# EasyEDA Pro project ProPrj_HPMDuino_DEV_2025-07-16.epro, board Board1_钢网
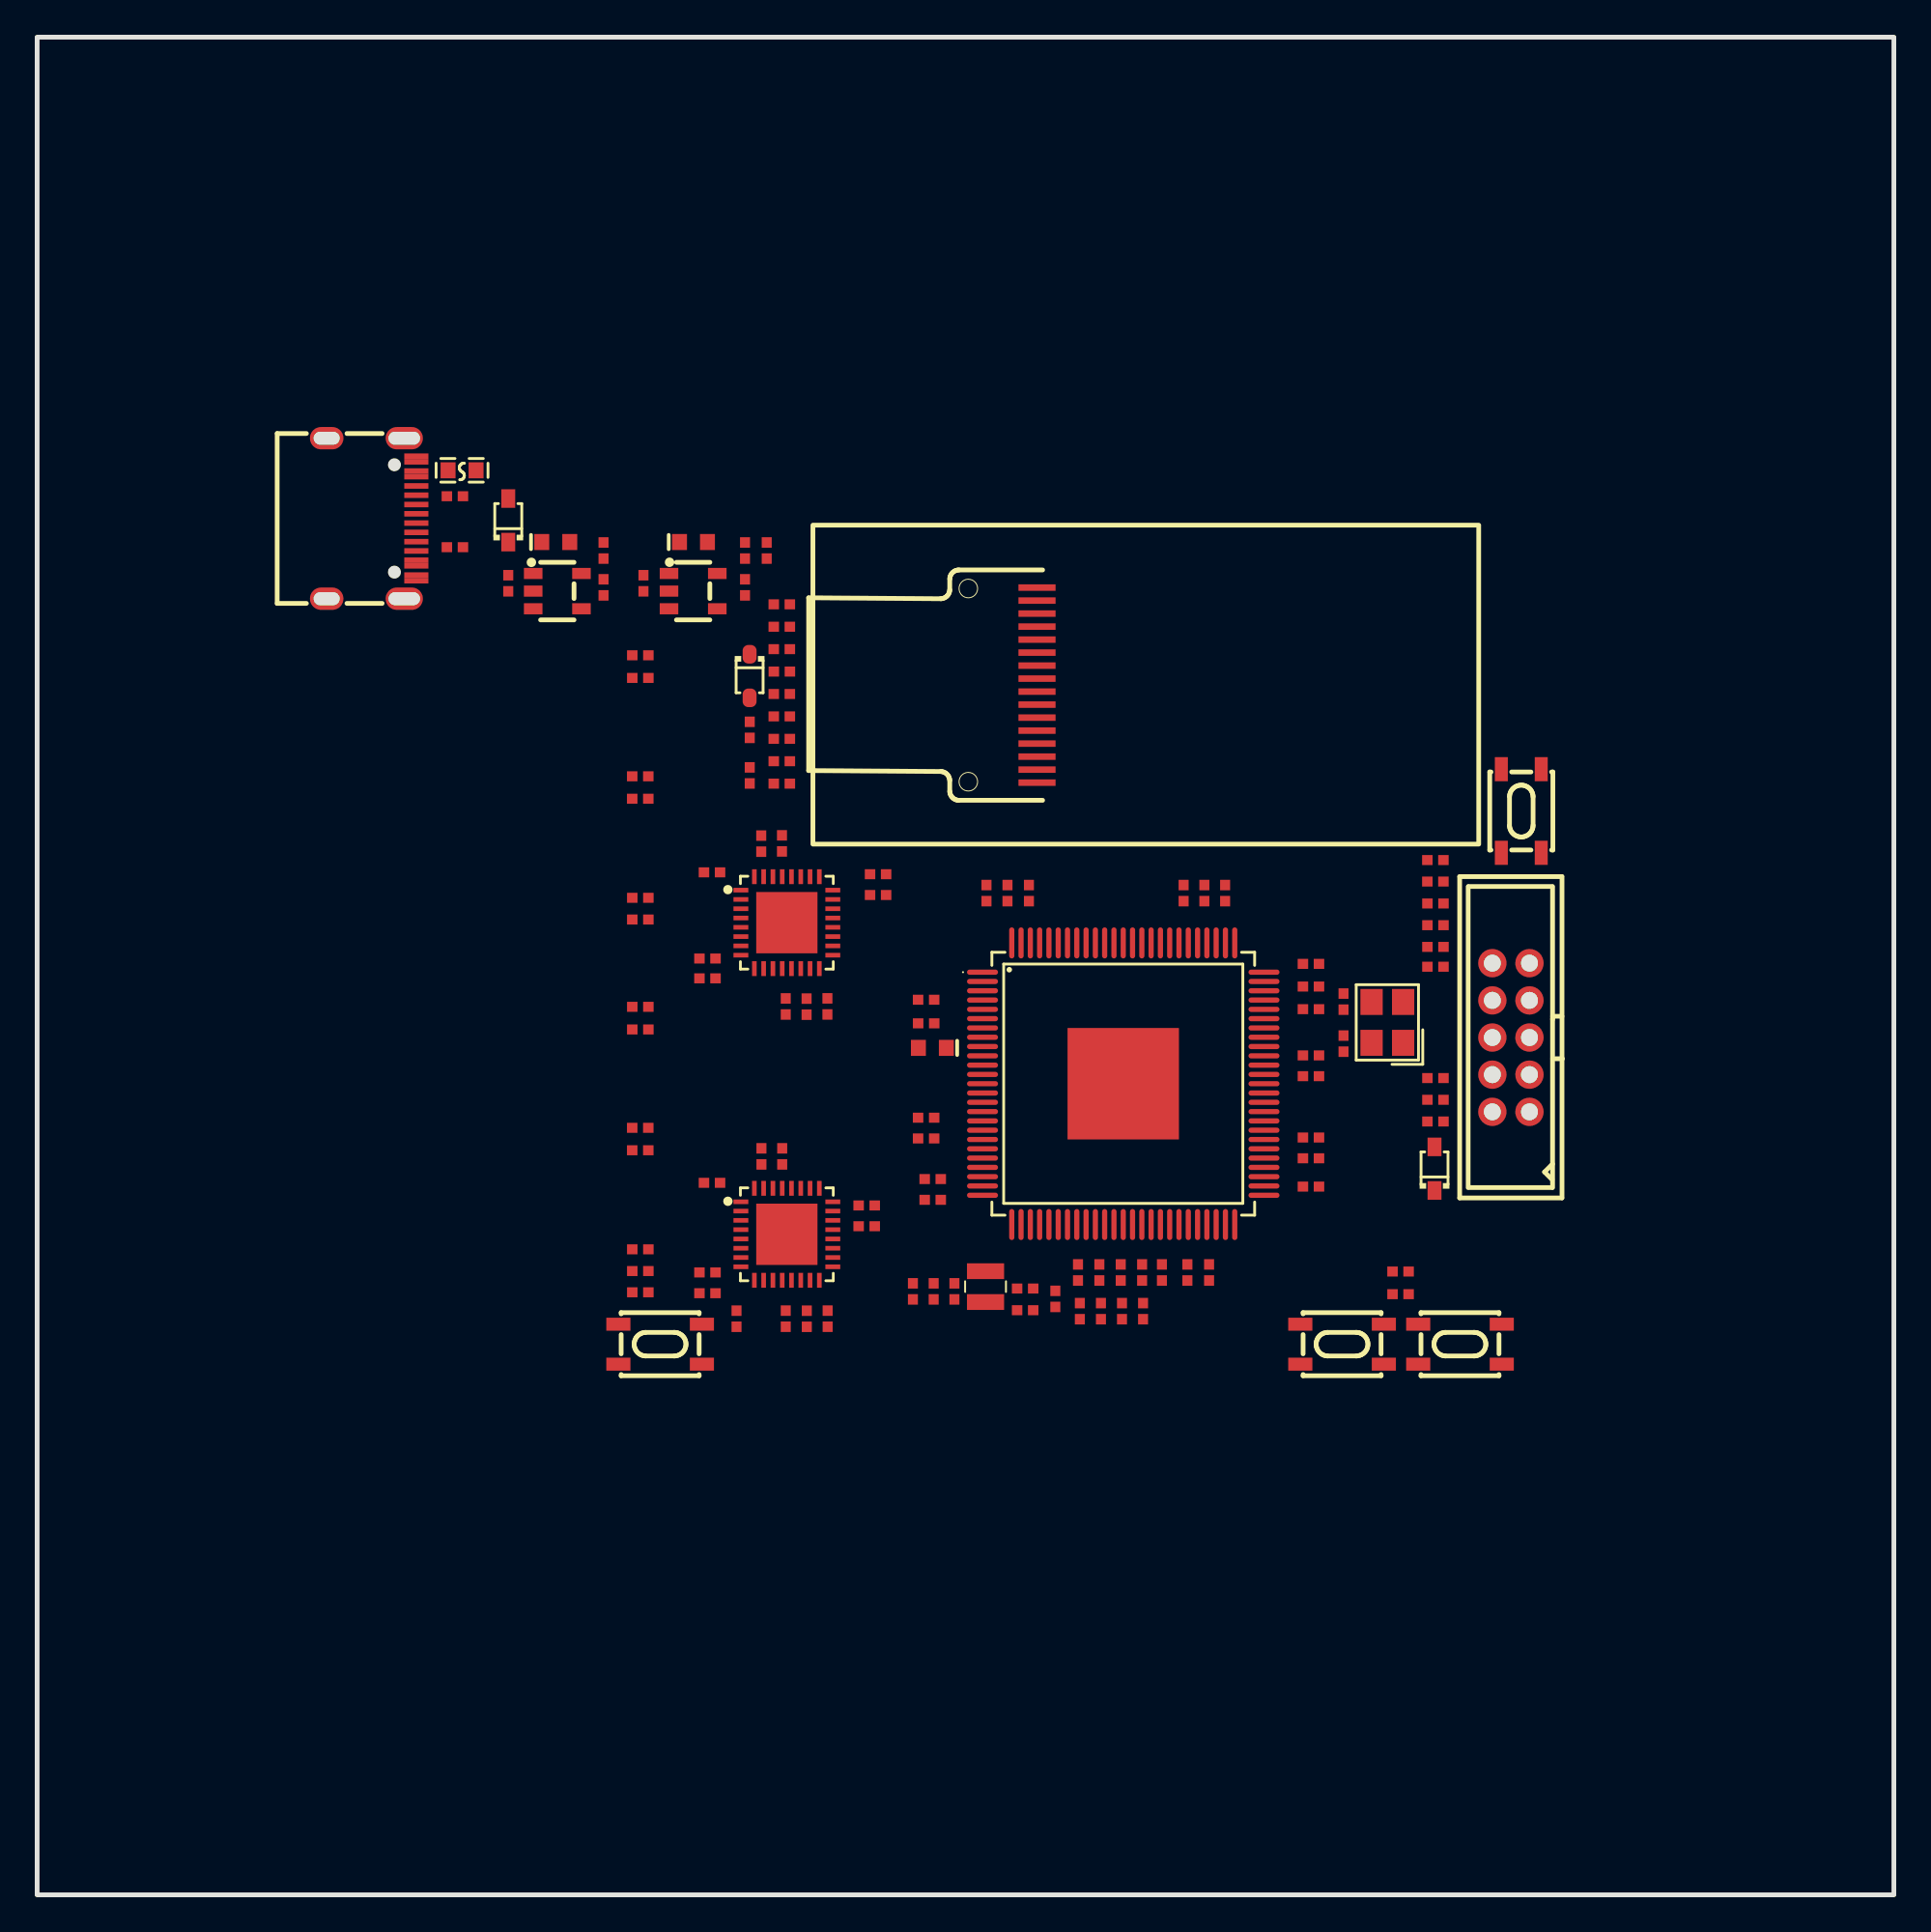
[diagram p2: board, top side]
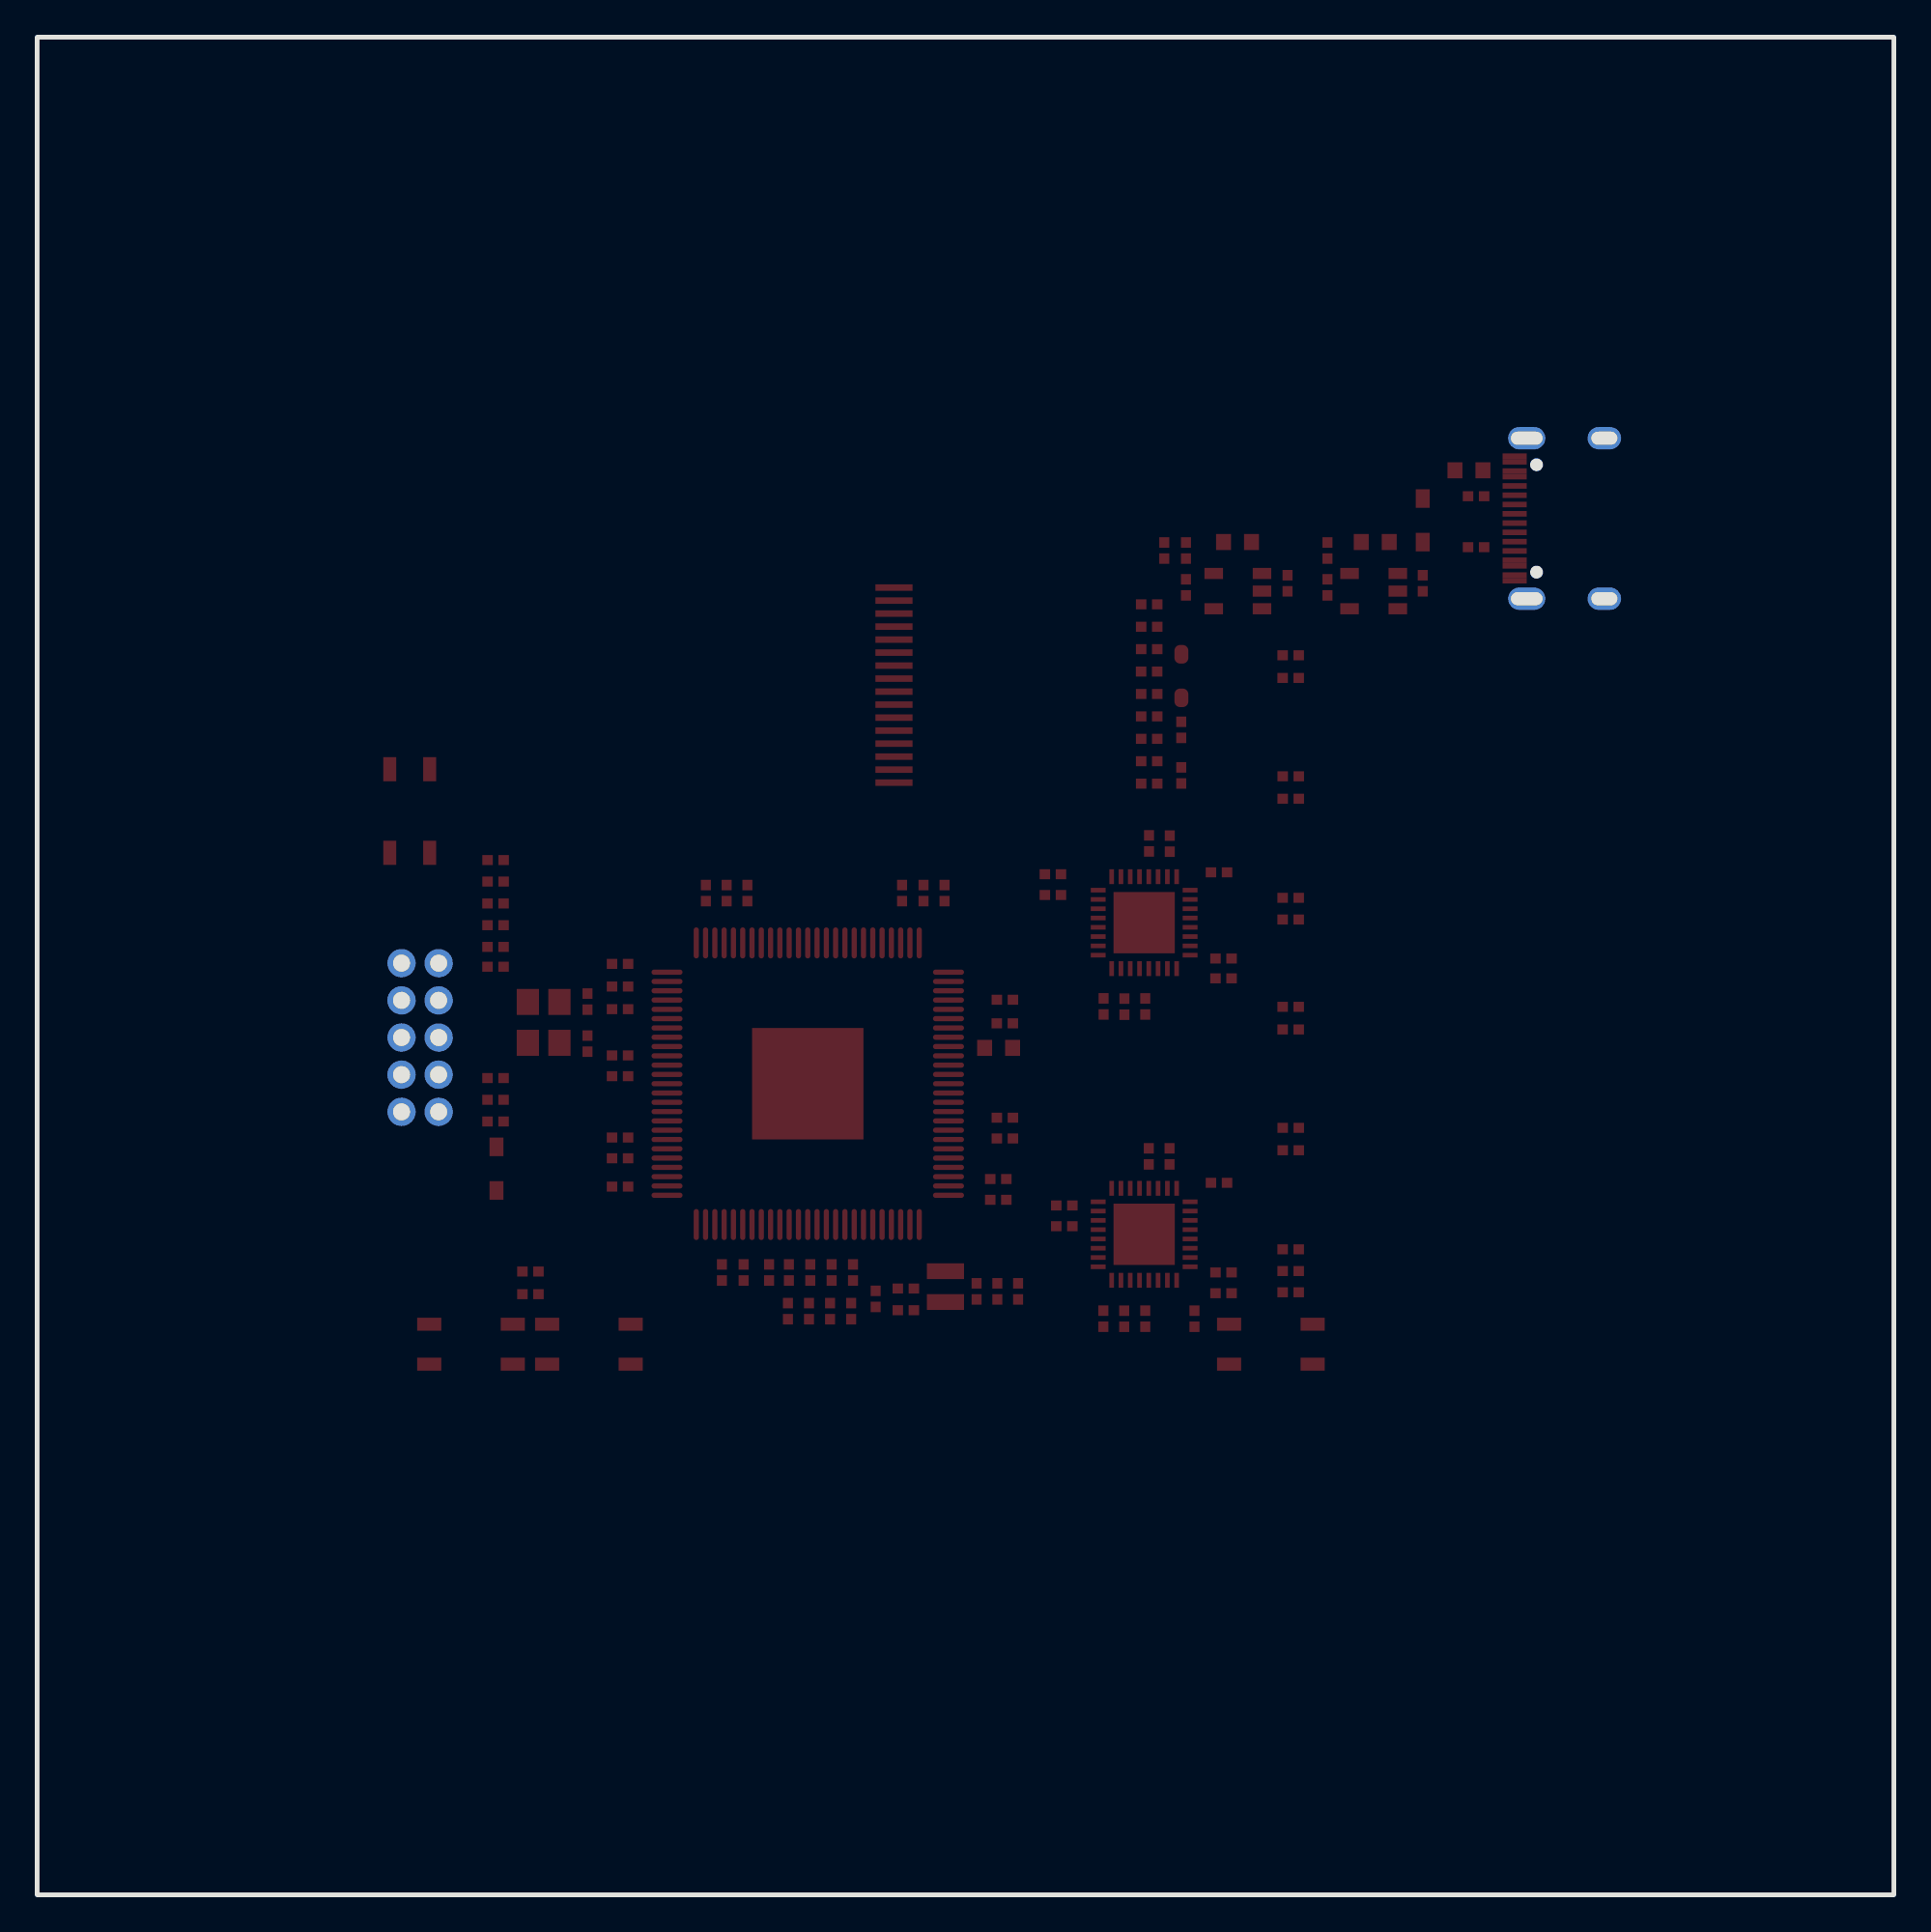
[diagram p3: board, bottom side, seen from below]

Outline 100 x 100 mm; copper layers: Top Layer, Bottom Layer. Coordinates in mm from the lower left corner of the outline.
Outline path: rectangle 0,100 100,0
Stack: Top Layer 0.035mm / Dielectric1 1.51mm FR4 er 4.5 / Bottom Layer 0.035mm

## Design rules (mm)
template: JLCPCB Capability(Two Layers Board)
spacing copperThickness1oz (default): track to track 0.102, other pairs 0.152 to 0.3
spacing copperThickness2oz: track to track 0.203, other pairs 0.152 to 0.3
track width copperThickness1oz (default): min 0.127, default 0.254, max 2.54
track width copperThickness2oz: min 0.203, default 0.254, max 2.54
differential pair differentialPair (default): width min 0.127, default 0.254, max 2.54; gap min 0.152, default 0.152
via viaSize (default): diameter min 0.5, default 0.61, max 10; hole min 0.3, default 0.305, max 6.3

## Placement (name value [footprint] x y rotation side)
C1  15pF  [c0402-无丝印-全尺寸_2]  70.36 45.82 90 top
C2  1uF  [c0402-无丝印-全尺寸_2]  25.37 70.6 90 top
C3  1uF  [c0402-无丝印-全尺寸_2]  30.51 70.38 90 top
C4  15pF  [c0402-无丝印-全尺寸_2]  70.36 48.08 270 top
C5  1uF  [c0402-无丝印-全尺寸_2]  32.66 70.6 90 top
C6  1uF  [c0402-无丝印-全尺寸_2]  38.13 70.38 90 top
C7  22uF  [c0402-无丝印-全尺寸_2]  47.17 32.49 270 top
C8  22uF  [c0402-无丝印-全尺寸_2]  48.29 32.49 270 top
C9  100nF  [c0402-无丝印-全尺寸_2]  49.4 32.49 270 top
C10  100nF  [c0402-无丝印-全尺寸_2]  47.88 48.18 0 top
C11  100nF  [c0402-无丝印-全尺寸_2]  68.61 38.13 180 top
C12  100nF  [c0402-无丝印-全尺寸_2]  68.61 47.68 180 top
C13  100nF  [c0402-无丝印-全尺寸_2]  63.98 53.92 270 top
C14  100nF  [c0402-无丝印-全尺寸_2]  53.42 53.92 270 top
C15  100nF  [c0402-无丝印-全尺寸_2]  75.31 55.7 0 top
C16  100nF  [c0402-无丝印-全尺寸_2]  37.67 31.01 90 top
C17  22uF  [c0402-无丝印-全尺寸_2]  53.21 32.64 0 top
C18  22uF  [c0402-无丝印-全尺寸_2]  53.21 31.47 0 top
C19  100nF  [c0402-无丝印-全尺寸_2]  54.84 32.08 90 top
C20  10uF  [c0402-无丝印-全尺寸_2]  56.16 31.42 90 top
C21  100nF  [c0402-无丝印-全尺寸_2]  56.06 33.5 90 top
C22  10uF  [c0402-无丝印-全尺寸_2]  48.23 37.41 0 top
C23  100nF  [c0402-无丝印-全尺寸_2]  48.23 38.53 0 top
C24  10uF  [c0402-无丝印-全尺寸_2]  58.43 31.42 90 top
C25  10uF  [c0402-无丝印-全尺寸_2]  57.29 31.42 90 top
C26  100nF  [c0402-无丝印-全尺寸_2]  57.21 33.5 90 top
C27  10uF  [c0402-无丝印-全尺寸_2]  59.56 31.42 90 top
C28  100nF  [c0402-无丝印-全尺寸_2]  58.36 33.5 90 top
C29  10uF  [c0402-无丝印-全尺寸_2]  60.58 33.5 90 top
C30  100nF  [c0402-无丝印-全尺寸_2]  59.51 33.5 90 top
C31  10uF  [c0402-无丝印-全尺寸_2]  47.88 41.83 0 top
C32  100nF  [c0402-无丝印-全尺寸_2]  47.88 40.72 0 top
C33  10uF  [c0402-无丝印-全尺寸_2]  68.61 50.11 180 top
C34  100nF  [c0402-无丝印-全尺寸_2]  68.61 48.9 180 top
C35  10uF  [c0402-无丝印-全尺寸_2]  62.86 53.92 270 top
C36  100nF  [c0402-无丝印-全尺寸_2]  61.75 53.92 270 top
C37  10uF  [c0402-无丝印-全尺寸_2]  51.13 53.92 270 top
C38  100nF  [c0402-无丝印-全尺寸_2]  52.26 53.92 270 top
C39  10uF  [c0402-无丝印-全尺寸_2]  68.61 40.77 180 top
C40  100nF  [c0402-无丝印-全尺寸_2]  68.61 39.65 180 top
C41  10uF  [c0402-无丝印-全尺寸_2]  68.61 44.07 180 top
C42  100nF  [c0402-无丝印-全尺寸_2]  68.61 45.19 180 top
C43  10uF  [c0402-无丝印-全尺寸_2]  63.12 33.5 90 top
C44  100nF  [c0402-无丝印-全尺寸_2]  61.95 33.5 90 top
C45  10uF  [c0402-无丝印-全尺寸_2]  36.1 49.34 0 top
C46  100nF  [c0402-无丝印-全尺寸_2]  36.1 50.4 0 top
C47  100nF  [c0402-无丝印-全尺寸_2]  41.44 47.81 90 top
C48  10uF  [c0402-无丝印-全尺寸_2]  39 56.59 270 top
C49  100nF  [c0402-无丝印-全尺寸_2]  40.12 56.6 270 top
C50  100nF  [c0402-无丝印-全尺寸_2]  32.48 59 0 top
C51  100nF  [c0402-无丝印-全尺寸_2]  32.48 60.21 0 top
C52  100nF  [c0402-无丝印-全尺寸_2]  45.29 53.82 180 top
C53  10uF  [c0402-无丝印-全尺寸_2]  36.1 32.39 0 top
C54  100nF  [c0402-无丝印-全尺寸_2]  41.45 31.01 90 top
C55  100nF  [c0402-无丝印-全尺寸_2]  36.1 33.5 0 top
C56  1uF  [c0402-无丝印-全尺寸_2]  40.11 69.47 0 top
C57  1uF  [c0402-无丝印-全尺寸_2]  40.11 68.26 0 top
C58  4.7uF  [c0402-无丝印-全尺寸_2]  40.11 65.85 180 top
C59  100nF  [c0402-无丝印-全尺寸_2]  40.11 67.06 0 top
C60  10uF  [c0402-无丝印-全尺寸_2]  39.01 39.75 270 top
C61  100nF  [c0402-无丝印-全尺寸_2]  40.13 39.75 270 top
C62  100nF  [c0402-无丝印-全尺寸_2]  32.48 40.08 0 top
C63  2.2uF  [c0402-无丝印-全尺寸_2]  40.11 64.64 0 top
C64  100nF  [c0402-无丝印-全尺寸_2]  32.48 41.29 0 top
C65  4.7uF  [c0402-无丝印-全尺寸_2]  38.38 60.26 90 top
D1  B16WS  [SOD-323_L1.8-W1.3-LS2.5-RD#2]  25.37 73.99 90 top
D2  B16WS  [SOD-323_L1.8-W1.3-LS2.5-RD#2]  75.26 39.09 90 top
D3  1N4148WS  [SOD-323_L1.8-W1.3-LS2.5-RD]  38.37 65.61 270 top
F1  BSMD0603-075-6V  [F0603]  22.89 76.68 0 top
L1  4.7uH  [IND-SMD_L2.5-W2.0-VLS252012CX-150M]  51.08 32.74 270 top
L2  NCD0603G1  [LED0603_S]  48.84 45.59 0 top
L3  NCD0603G1  [LED0603_S]  27.3 72.82 180 top
L4  NCD0603G1  [LED0603_S]  34.72 72.82 180 top
OLED1  -  [1.29'OLED-64x128-16P]  59.46 65.1 180 top
P1  2.0-2*5P直简牛  [IDC-TH_10P-P2.00-V-R2-C5-S2.00]  79.37 46.15 90 top
R1  10K  [r0402-无丝印-全尺寸_1]  75.31 54.55 0 top
R2  10K  [r0402-无丝印-全尺寸_1]  47.88 46.91 180 top
R3  0Ω  [r0402-无丝印-全尺寸_1]  39.29 72.37 90 top
R4  10K  [r0402-无丝印-全尺寸_1]  32.49 32.44 180 top
R5  10K  [r0402-无丝印-全尺寸_1]  73.43 32.33 0 top
R6  10K  [r0402-无丝印-全尺寸_1]  30.51 72.37 90 top
R7  10K  [r0402-无丝印-全尺寸_1]  38.13 72.37 90 top
R8  10K  [r0402-无丝印-全尺寸_1]  73.43 33.55 0 top
R9  33Ω  [r0402-无丝印-全尺寸_1]  42.56 47.83 270 top
R10  33Ω  [r0402-无丝印-全尺寸_1]  40.32 47.82 270 top
R11  5.1K  [r0402-无丝印-全尺寸_1]  22.5 75.29 0 top
R12  5.1K  [r0402-无丝印-全尺寸_1]  22.5 72.55 0 top
R13  100Ω  [r0402-无丝印-全尺寸_1]  75.31 52.2 180 top
R14  100Ω  [r0402-无丝印-全尺寸_1]  75.31 49.96 180 top
R15  10K  [r0402-无丝印-全尺寸_1]  75.31 53.37 180 top
R16  100Ω  [r0402-无丝印-全尺寸_1]  75.31 43.97 180 top
R17  10K  [r0402-无丝印-全尺寸_1]  75.31 51.03 180 top
R18  100Ω  [r0402-无丝印-全尺寸_1]  75.31 41.63 180 top
R19  10K  [r0402-无丝印-全尺寸_1]  75.31 42.8 180 top
R20  4.7K  [r0402-无丝印-全尺寸_1]  32.49 66.73 180 top
R21  2.49K  [r0402-无丝印-全尺寸_1]  36.35 55.04 180 top
R22  330Ω  [r0402-无丝印-全尺寸_1]  32.49 65.51 180 top
R23  10K  [r0402-无丝印-全尺寸_1]  45.29 54.94 180 top
R24  4.7K  [r0402-无丝印-全尺寸_1]  32.49 52.5 180 top
R25  330Ω  [r0402-无丝印-全尺寸_1]  32.49 53.67 180 top
R26  33Ω  [r0402-无丝印-全尺寸_1]  42.57 31.02 270 top
R27  390K  [r0402-无丝印-全尺寸_1]  40.11 63.44 0 top
R28  33Ω  [r0402-无丝印-全尺寸_1]  40.32 31.02 270 top
R29  4.7K  [r0402-无丝印-全尺寸_1]  38.38 62.71 90 top
R30  4.7K  [r0402-无丝印-全尺寸_1]  40.11 62.23 0 top
R31  4.7K  [r0402-无丝印-全尺寸_1]  40.11 61.02 0 top
R32  4.7K  [r0402-无丝印-全尺寸_1]  44.68 35.99 0 top
R33  4.7K  [r0402-无丝印-全尺寸_1]  44.68 37.11 0 top
R34  4.7K  [r0402-无丝印-全尺寸_1]  40.11 59.82 0 top
R35  4.7K  [r0402-无丝印-全尺寸_1]  32.49 47.8 180 top
R36  2.49K  [r0402-无丝印-全尺寸_1]  36.35 38.33 180 top
R37  330Ω  [r0402-无丝印-全尺寸_1]  32.49 46.58 180 top
R38  4.7K  [r0402-无丝印-全尺寸_1]  32.49 33.58 180 top
R39  330Ω  [r0402-无丝印-全尺寸_1]  32.49 34.75 180 top
SW1  PTS815SJK250SMTRLFS  [SW-SMD_4P-L4.2-W3.3-P2.15-LS5.1]  33.55 29.64 0 top
SW2  PTS815SJK250SMTRLFS  [SW-SMD_4P-L4.2-W3.3-P2.15-LS5.1]  79.93 58.34 90 top
SW3  PTS815SJK250SMTRLFS  [SW-SMD_4P-L4.2-W3.3-P2.15-LS5.1]  76.63 29.64 0 top
SW4  PTS815SJK250SMTRLFS  [SW-SMD_4P-L4.2-W3.3-P2.15-LS5.1]  70.28 29.64 0 top
U1  XC6210B332MR  [SOT-23-5_L3.0-W1.7-P0.95-LS2.8-BR]  28.02 70.18 180 top
U2  LP5907QMFX-3.3Q1  [SOT-23-5_L3.0-W1.7-P0.95-LS2.8-BR]  35.33 70.18 180 top
U3  JL1111-N032I  [QFN-32_L5.0-W5.0-P0.50-TL-EP3.3]  40.38 52.33 0 top
U4  JL1111-N032I  [QFN-32_L5.0-W5.0-P0.50-TL-EP3.3]  40.38 35.56 0 top
U5  -  [eLQFP-100]  58.5 43.66 0 top
USB1  KH-TYPE-C-16P  [USB-C-SMD_KH-TYPE-C-16P]  18.01 74.09 270 top
X1  24MHz  [CRYSTAL-SMD_4P-L3.2-W2.5-BL]  72.72 46.97 90 top

## Footprints (pads in the part's own frame, mm; a bottom-side part is the same pattern mirrored in y, then rotated)
1.29'OLED-64x128-16P
  rect 2x0.35 smd: 1(5.61,-5.27) 2(5.61,-4.57) 3(5.61,-3.87) 4(5.61,-3.17) 5(5.61,-2.47) 6(5.61,-1.77) 7(5.61,-1.07) 8(5.61,-0.37) 9(5.61,0.33) 10(5.61,1.03) 11(5.61,1.73) 12(5.61,2.43) 13(5.61,3.13) 14(5.61,3.83) 15(5.61,4.53) 16(5.61,5.23)
c0402-无丝印-全尺寸_2
  rect 0.566x0.54 smd: 1(-0.433,0) 2(0.433,0)
CRYSTAL-SMD_4P-L3.2-W2.5-BL
  rect 1.4x1.2 smd: 1(-1.1,-0.85) 2(1.1,-0.85) 3(1.1,0.85) 4(-1.1,0.85)
eLQFP-100
  oval 1.67x0.28 smd: 1(-7.58,6.005) 2(-7.58,5.504) 3(-7.58,5.004) 4(-7.58,4.503) 5(-7.58,4.003) 6(-7.58,3.502) 7(-7.58,3.002) 8(-7.58,2.502) 9(-7.58,2.002) 10(-7.58,1.501) 11(-7.58,1.001) 12(-7.58,0.5) 13(-7.58,0) 14(-7.58,-0.5) 15(-7.58,-1.001) 16(-7.58,-1.501) 17(-7.58,-2.002) 18(-7.58,-2.502) 19(-7.58,-3.002) 20(-7.58,-3.502) 21(-7.58,-4.003) 22(-7.58,-4.503) 23(-7.58,-5.004) 24(-7.58,-5.504) 25(-7.58,-6.005) 51(7.58,-6.005) 52(7.58,-5.504) 53(7.58,-5.004) 54(7.58,-4.503) 55(7.58,-4.003) 56(7.58,-3.502) 57(7.58,-3.002) 58(7.58,-2.502) 59(7.58,-2.002) 60(7.58,-1.501) 61(7.58,-1.001) 62(7.58,-0.5) 63(7.58,0) 64(7.58,0.5) 65(7.58,1.001) 66(7.58,1.501) 67(7.58,2.002) 68(7.58,2.502) 69(7.58,3.002) 70(7.58,3.502) 71(7.58,4.003) 72(7.58,4.503) 73(7.58,5.004) 74(7.58,5.504) 75(7.58,6.005)
  oval 0.28x1.67 smd: 26(-6.005,-7.58) 27(-5.504,-7.58) 28(-5.004,-7.58) 29(-4.503,-7.58) 30(-4.003,-7.58) 31(-3.502,-7.58) 32(-3.002,-7.58) 33(-2.502,-7.58) 34(-2.002,-7.58) 35(-1.501,-7.58) 36(-1.001,-7.58) 37(-0.5,-7.58) 38(0,-7.58) 39(0.5,-7.58) 40(1.001,-7.58) 41(1.501,-7.58) 42(2.002,-7.58) 43(2.502,-7.58) 44(3.002,-7.58) 45(3.502,-7.58) 46(4.003,-7.58) 47(4.503,-7.58) 48(5.004,-7.58) 49(5.504,-7.58) 50(6.005,-7.58) 76(6.005,7.58) 77(5.504,7.58) 78(5.004,7.58) 79(4.503,7.58) 80(4.003,7.58) 81(3.502,7.58) 82(3.002,7.58) 83(2.502,7.58) 84(2.002,7.58) 85(1.501,7.58) 86(1.001,7.58) 87(0.5,7.58) 88(0,7.58) 89(-0.5,7.58) 90(-1.001,7.58) 91(-1.501,7.58) 92(-2.002,7.58) 93(-2.502,7.58) 94(-3.002,7.58) 95(-3.502,7.58) 96(-4.003,7.58) 97(-4.503,7.58) 98(-5.004,7.58) 99(-5.504,7.58) 100(-6.005,7.58)
  rect 6x6 smd: 101(0,0)
F0603
  rect 0.806x0.864 smd: 1(-0.753,0) 2(0.753,0)
IDC-TH_10P-P2.00-V-R2-C5-S2.00
  round 1.524 hole 0.914: 1(-4.002,-1) 2(-4.002,1) 3(-2.001,-1) 4(-2.001,1) 5(-0.002,-1) 6(-0.002,1) 7(1.998,-1) 8(1.998,1) 9(4.002,-1) 10(4.002,1)
IND-SMD_L2.5-W2.0-VLS252012CX-150M
  rect 0.85x2 smd: 1(-0.83,0) 2(0.83,0)
LED0603_S
  rect 0.806x0.864 smd: 1(-1.381,-0.001) 2(0.126,-0.001)
QFN-32_L5.0-W5.0-P0.50-TL-EP3.3
  rect 0.8x0.25 smd: 1(-2.475,1.75) 2(-2.475,1.25) 3(-2.475,0.75) 4(-2.475,0.25) 5(-2.475,-0.25) 6(-2.475,-0.75) 7(-2.475,-1.25) 8(-2.475,-1.75) 17(2.475,-1.75) 18(2.475,-1.25) 19(2.475,-0.75) 20(2.475,-0.25) 21(2.475,0.25) 22(2.475,0.75) 23(2.475,1.25) 24(2.475,1.75)
  rect 0.25x0.8 smd: 9(-1.75,-2.475) 10(-1.25,-2.475) 11(-0.75,-2.475) 12(-0.25,-2.475) 13(0.25,-2.475) 14(0.75,-2.475) 15(1.25,-2.475) 16(1.75,-2.475) 25(1.75,2.475) 26(1.25,2.475) 27(0.75,2.475) 28(0.25,2.475) 29(-0.25,2.475) 30(-0.75,2.475) 31(-1.25,2.475) 32(-1.75,2.475)
  rect 3.3x3.3 smd: 33(0,0)
r0402-无丝印-全尺寸_1
  rect 0.566x0.54 smd: 1(-0.433,0) 2(0.433,0)
SOD-323_L1.8-W1.3-LS2.5-RD
  rrect 1x0.75 smd: 1(-1.173,0) 2(1.173,0)
SOD-323_L1.8-W1.3-LS2.5-RD#2
  rect 1x0.75 smd: 1(-1.173,0) 2(1.173,0)
SOT-23-5_L3.0-W1.7-P0.95-LS2.8-BR
  rect 1x0.6 smd: 1(1.3,-0.95) 2(1.3,0) 3(1.3,0.95) 4(-1.3,0.95) 5(-1.3,-0.95)
SW-SMD_4P-L4.2-W3.3-P2.15-LS5.1
  rect 1.3x0.7 smd: 1(-2.25,1.075) 2(2.25,1.075) 3(-2.25,-1.075) 4(2.25,-1.075)
USB-C-SMD_KH-TYPE-C-16P
  oval 1.2x2 hole 0.7x1.7: 1(-4.32,1.765) 2(4.32,1.765)
  oval 1.2x1.8 hole 0.7x1.4: 3(-4.32,-2.415) 4(4.32,-2.415)
  rect 0.3x1.3 smd: A1(-3.35,2.415) A4(-2.55,2.415) A5(-1.25,2.415) A6(-0.25,2.415) A7(0.25,2.415) A8(1.25,2.415) A9(2.55,2.415) A12(3.35,2.415) B1(3.05,2.415) B4(2.25,2.415) B5(1.75,2.415) B6(0.75,2.415) B7(-0.75,2.415) B8(-1.75,2.415) B9(-2.25,2.415) B12(-3.05,2.415)

## Nets
+5V: C2.2 C5.2 D1.1 D2.1 U1.1 U1.3 U2.1 U2.3
AGND: C6.1 C27.1 C28.1 C29.1 C30.1 R3.1 U5.38
AVCC: C6.2 C27.2 C28.2 C29.2 C30.2 R7.1 U2.5 U5.37 U5.39
GND: C1.1 C2.1 C3.1 C4.1 C5.1 C7.1 C8.1 C9.1 C10.1 C11.1 C12.1 C13.1 C14.1 C15.1 C16.1 C17.1 C18.1 C19.1 C20.1 C21.1 C22.1 C23.1 C24.1 C25.1 C26.1 C31.1 C32.1 C33.1 C34.1 C35.1 C36.1 C37.1 C38.1 C39.1 C40.1 C41.1 C42.1 C43.1 C44.1 C45.1 C46.1 C47.1 C48.1 C49.1 C50.2 C51.2 C52.1 C53.1 C54.1 C55.1 C58.2 C59.1 C60.1 C61.1 C62.2 C63.1 C64.2 C65.1 L3.2 L4.2 OLED1.9 OLED1.11 OLED1.12 P1.9 R3.2 R4.1 R11.2 R12.2 R15.2 R20.1 R21.2 R22.1 R27.1 R36.2 R38.1 R39.1 SW2.1 U1.2 U2.2 U3.33 U4.33 U5.29 U5.101 USB1.1 USB1.2 USB1.3 USB1.4 USB1.A1 USB1.A12 USB1.B1 USB1.B12 X1.2 X1.4
VBUS: F1.1 USB1.A4 USB1.A9 USB1.B4 USB1.B9
VDD_OTPCAP: C22.2 C23.2 U5.23
VDD_PMCCAP: C24.2 C25.2 C26.2 U5.34
_JTAG_TCK: P1.7 R13.1 R15.1
_JTAG_TDI: P1.6 R16.1 R19.1
_JTAG_TDO: P1.4 R18.1
_JTAG_TMS: P1.5 R14.1 R17.1
BOOT0: R5.1 U5.7
BOOT1: R8.1 U5.6
DCDC_IN: C3.2 C17.2 C18.2 C19.2 C20.2 C21.2 C31.2 C32.2 C33.2 C34.2 C35.2 C36.2 C37.2 C38.2 C39.2 C40.2 C41.2 C42.2 C43.2 C44.2 C45.2 C46.2 C47.2 C53.2 C54.2 C55.2 D3.1 OLED1.5 OLED1.14 P1.3 R1.1 R2.1 R6.1 R17.2 R19.2 R23.1 R24.2 R29.2 R30.1 R31.1 R32.2 R33.2 R34.1 R35.2 SW1.1 SW3.4 SW4.4 U1.5 U3.7 U3.14 U4.7 U4.14 U5.19 U5.31 U5.33 U5.45 U5.55 U5.66 U5.72 U5.82 U5.99
DCDC_LP: L1.1 U5.30
DCDC_SNS: C7.2 C8.2 C9.2 C10.2 C11.2 C12.2 C13.2 C14.2 L1.2 U5.4 U5.32 U5.52 U5.71 U5.77 U5.98
ESC0_MDC: R32.1 U3.22 U4.22 U5.12
ESC0_MDIO: R33.1 U3.23 U4.23 U5.13
ESC0_P0_LED0: R24.1 R25.1 U3.24
ESC0_P0_LED1: R20.2 U3.25 U5.96
ESC0_P0_RD_N: U3.6
ESC0_P0_RD_P: U3.5
ESC0_P0_RXCK: R10.2 U5.20
ESC0_P0_RXD_0: U3.9 U5.27
ESC0_P0_RXD_1: U3.10 U5.26
ESC0_P0_RXD_2: U3.11 U5.25
ESC0_P0_RXD_3: U3.12 U5.21
ESC0_P0_RXDV: U3.8 U5.28
ESC0_P0_RXER: U3.28 U5.15
ESC0_P0_TD_N: U3.4
ESC0_P0_TD_P: U3.3
ESC0_P0_TXCK: R9.2 U5.24
ESC0_P0_TXD_0: U3.16 U5.22
ESC0_P0_TXD_1: U3.17 U5.18
ESC0_P0_TXD_2: U3.18 U5.17
ESC0_P0_TXD_3: U3.19 U5.16
ESC0_P0_TXEN: U3.20 U5.14
ESC0_P1_LED0: R38.2 U4.24
ESC0_P1_LED1: R35.1 R37.1 U4.25 U5.95
ESC0_P1_RD_N: U4.6
ESC0_P1_RD_P: U4.5
ESC0_P1_RXCK: R28.2 U5.59
ESC0_P1_RXD_0: U4.9 U5.62
ESC0_P1_RXD_1: U4.10 U5.53
ESC0_P1_RXD_2: U4.11 U5.65
ESC0_P1_RXD_3: U4.12 U5.60
ESC0_P1_RXDV: U4.8 U5.64
ESC0_P1_RXER: U4.28 U5.54
ESC0_P1_TD_N: U4.4
ESC0_P1_TD_P: U4.3
ESC0_P1_TXCK: R26.2 U5.57
ESC0_P1_TXD_0: U4.16 U5.63
ESC0_P1_TXD_1: U4.17 U5.51
ESC0_P1_TXD_2: U4.18 U5.56
ESC0_P1_TXD_3: U4.19 U5.58
ESC0_P1_TXEN: U4.20 U5.61
ESC0_REFCK: U3.31 U4.31 U5.5
ESC0_RESET: C52.2 R23.2 U3.21 U4.21 U5.97
JTAG_TCK: R13.2 U5.1
JTAG_TDI: R16.2 U5.2
JTAG_TDO: R18.2 U5.3
JTAG_TMS: R14.2 U5.100
JTAG_VDD: D2.2 P1.1
OLED_SCL: OLED1.15 R31.2 U5.73
OLED_SDA: OLED1.16 R34.2 U5.74
PB29: U5.94
PB30: U5.93
PB31: U5.92
PC08: U5.91
PC09: U5.90
PC10: U5.89
PC11: U5.88
PC12: U5.87
PC13: U5.86
PC14: U5.85
PC15: U5.84
PC16: U5.83
PD00: U5.81
PD01: U5.80
PD02: U5.79
PD03: U5.78
PD04: U5.76
PD05: U5.75
PF16: U5.47
PF18: U5.49
PF19: U5.42
PF20: U5.48
PF21: U5.44
PF22: U5.46
PF23: U5.43
PF24: U5.41
PF26: U5.50
PF27: U5.40
RSTN: C15.2 P1.2 R1.2 SW2.4 U5.35
SYS_LED: L2.2 U5.10
UART0_RX: P1.8 U5.9
UART0_TX: P1.10 U5.11
USB_DM: U5.67 USB1.A7 USB1.B7
USB_DP: U5.68 USB1.A6 USB1.B6
WKUP: C16.2 R4.2 SW1.4 U5.36
XTALI: C1.2 U5.69 X1.1
XTALO: C4.2 U5.70 X1.3
$1N11759: R12.1 USB1.B5
$1N11763: R11.1 USB1.A5
$1N18295: R9.1 U3.15
$1N18373: R10.1 U3.13
$1N18412: R26.1 U4.15
$1N18451: R28.1 U4.13
$1N18860: C48.2 C49.2 U3.29
$1N19227: R21.1 U3.1
$1N19752: C60.2 C61.2 U4.29
$1N19885: R36.1 U4.1
$1N20086: C50.1
$1N20091: C51.1
$1N20598: C62.1
$1N20602: C64.1
$1N20817: R37.2
$1N20822: R39.2
$1N24058: L2.1 R2.2
$1N37197: C56.1 OLED1.1
$1N37201: C56.2 OLED1.2
$1N37238: C57.1 OLED1.3
$1N37242: C57.2 OLED1.4
$1N37324: C58.1 C59.2 OLED1.6
$1N37461: C63.2 OLED1.7
$1N37500: OLED1.8 R27.2
$1N40416: OLED1.10 R30.2
$1N46347: C65.2 D3.2 OLED1.13 R29.1
$1N46902: R5.2 SW3.1
$1N61081: L3.1 R6.2
$1N61162: L4.1 R7.2
$1N72423: R8.2 SW4.1
$1N88332: D1.2 F1.2
$1N115083: R25.2
$1N115123: R22.2

Pads without a net: SW1 2 3; SW2 2 3; SW3 2 3; SW4 2 3; U1 4; U2 4; U3 2 26 27 30 32; U4 2 26 27 30 32; U5 8; USB1 A8 B8
